# EAGLE design umidade_V1.0 (EAGLE 4.09)
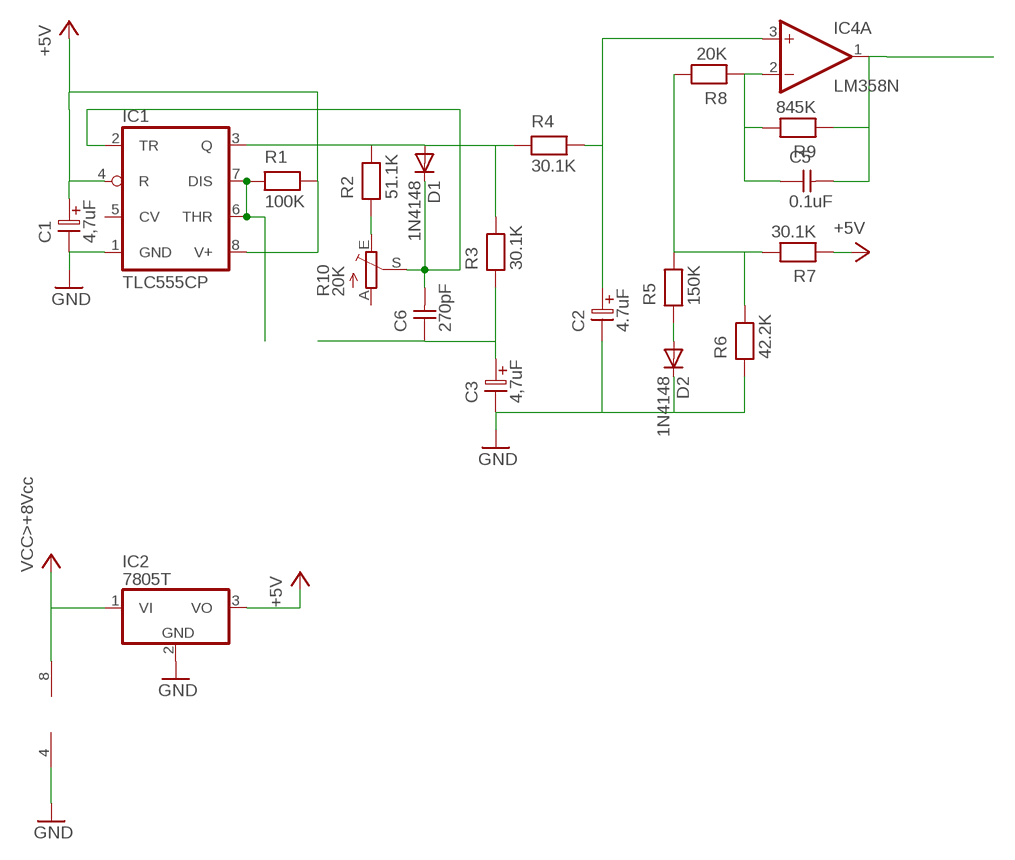
[diagram p0: schematic, sheet 1]

## Parts
C1  4,7uF  ELC-2,5L  [ES-2,5L]
C2  4.7uF  ELC-2,5L  [ES-2,5L]
C3  4,7uF  ELC-2,5L  [ES-2,5L]
C5  0.1uF  CAPNP-5  [C-5]
C6  270pF  CAPNP-2,5  [C-2,5]
D1  1N4148  [DO35-10]
D2  1N4148  [DO35-10]
IC1  TLC555CP  SE555N  [DIL08]
IC2  7805T  [TO220H]
IC4  LM358N  [DIL08]
R1  100K  RESEU-7,5  [R-7,5]
R2  51.1K  RESEU-7,5  [R-7,5]
R3  30.1K  RESEU-7,5  [R-7,5]
R4  30.1K  RESEU-7,5  [R-7,5]
R5  150K  RESEU-7,5  [R-7,5]
R6  42.2K  RESEU-7,5  [R-7,5]
R7  30.1K  RESEU-7,5  [R-7,5]
R8  20K  RESEU-7,5  [R-7,5]
R9  845K  RESEU-7,5  [R-7,5]
R10  20K  TRIM_EU-S64W  [S64W]

## Nets
+5V: C1.1 IC1.4(R) IC1.8(V+) IC2.3(VO) R1.2 R7.1
GND: C1.2 C2.2 C3.2 D2.C IC1.1(GND) IC2.2(GND) IC4.4(P:V-) R6.1
N$1: R2.1 R10.E
N$2: C6.2 D1.C IC1.2(TR) R10.S
N$3: IC1.6(THR) IC1.7(DIS) R1.1
N$4: D1.A IC1.3(Q) R2.2 R3.2 R4.1
N$6: C3.1 C6.1 R3.1
N$7: C5.2 IC4.1(A:OUT) R9.1
N$8: C5.1 IC4.2(A:-IN) R8.1 R9.2
N$9: D2.A R5.1
N$10: R5.2 R6.2 R7.2 R8.2
N$11: C2.1 IC4.3(A:+IN) R4.2
VCC>8VCC: IC2.1(VI) IC4.8(P:V+) ; supply symbol labelled VCC>+8Vcc
Unconnected: IC1.5(CV) IC4.5(B:+IN) IC4.6(B:-IN) IC4.7(B:OUT) R10.A

## Library data of the parts
C1-C3 = discrete:ELC-2,5L
C5 = discrete:CAPNP-5
C6 = discrete:CAPNP-2,5
D1 D2 = diode:1N4148: DIODE high speed (Philips)
IC1 = linear:*555: TIMER
IC2 = linear:78*: Positive VOLTAGE REGULATOR
IC4 = linear:LM358: OP AMP
R1-R9 = discrete:RESEU-7,5
R10 = pot:TRIM_EU-: POTENTIOMETER

## Board
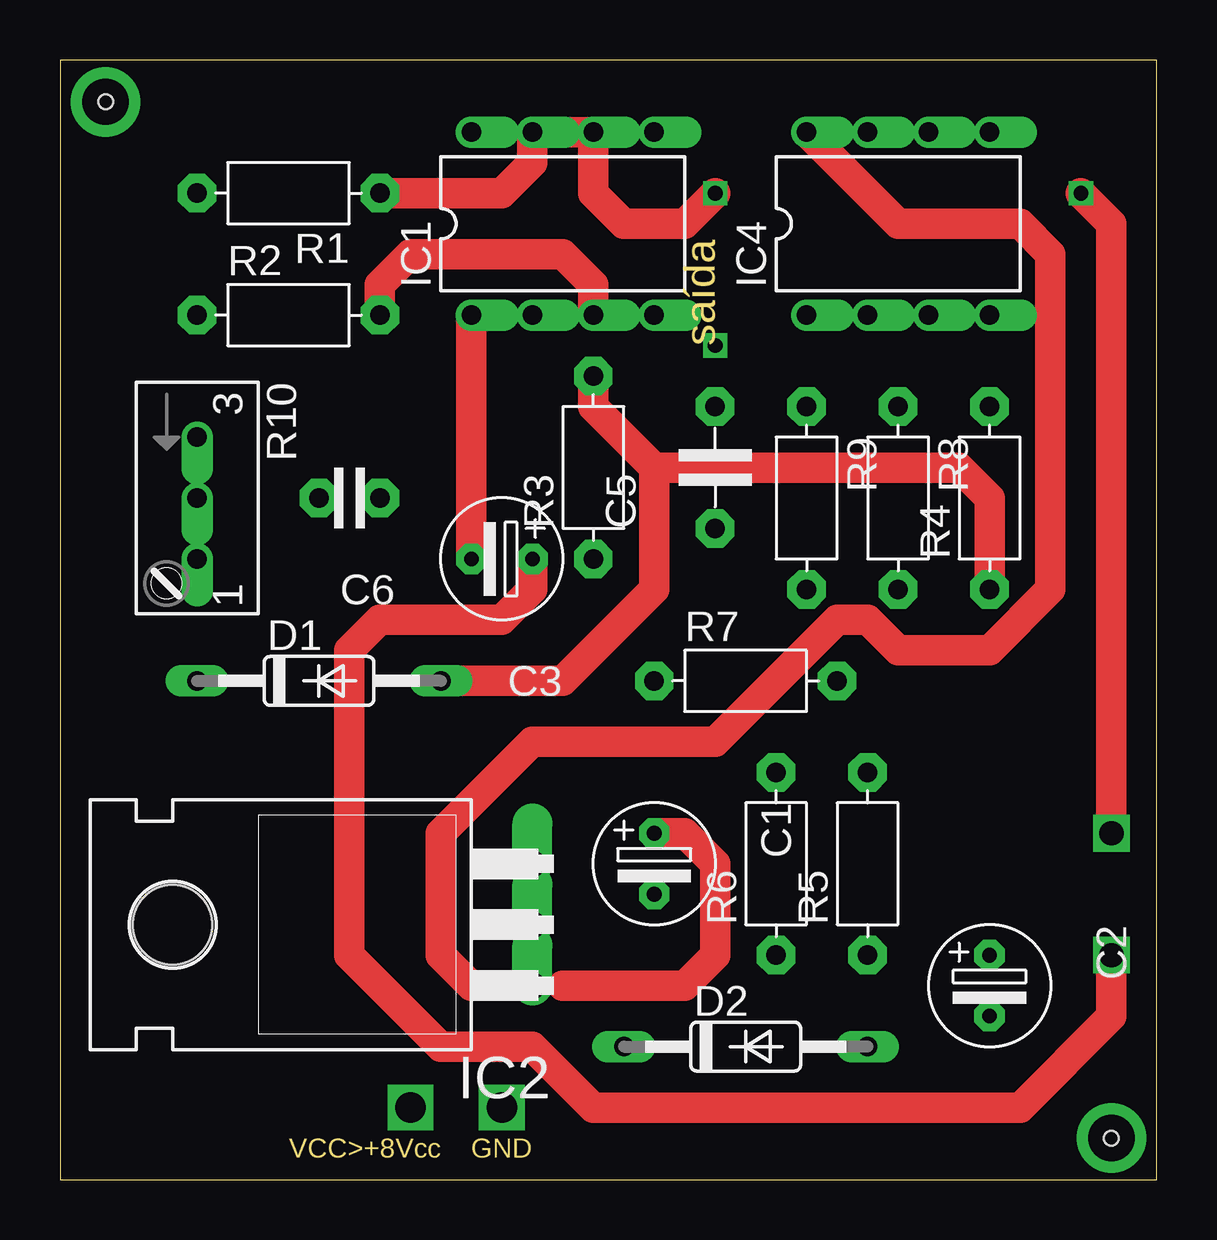
[diagram p1: board, top side]
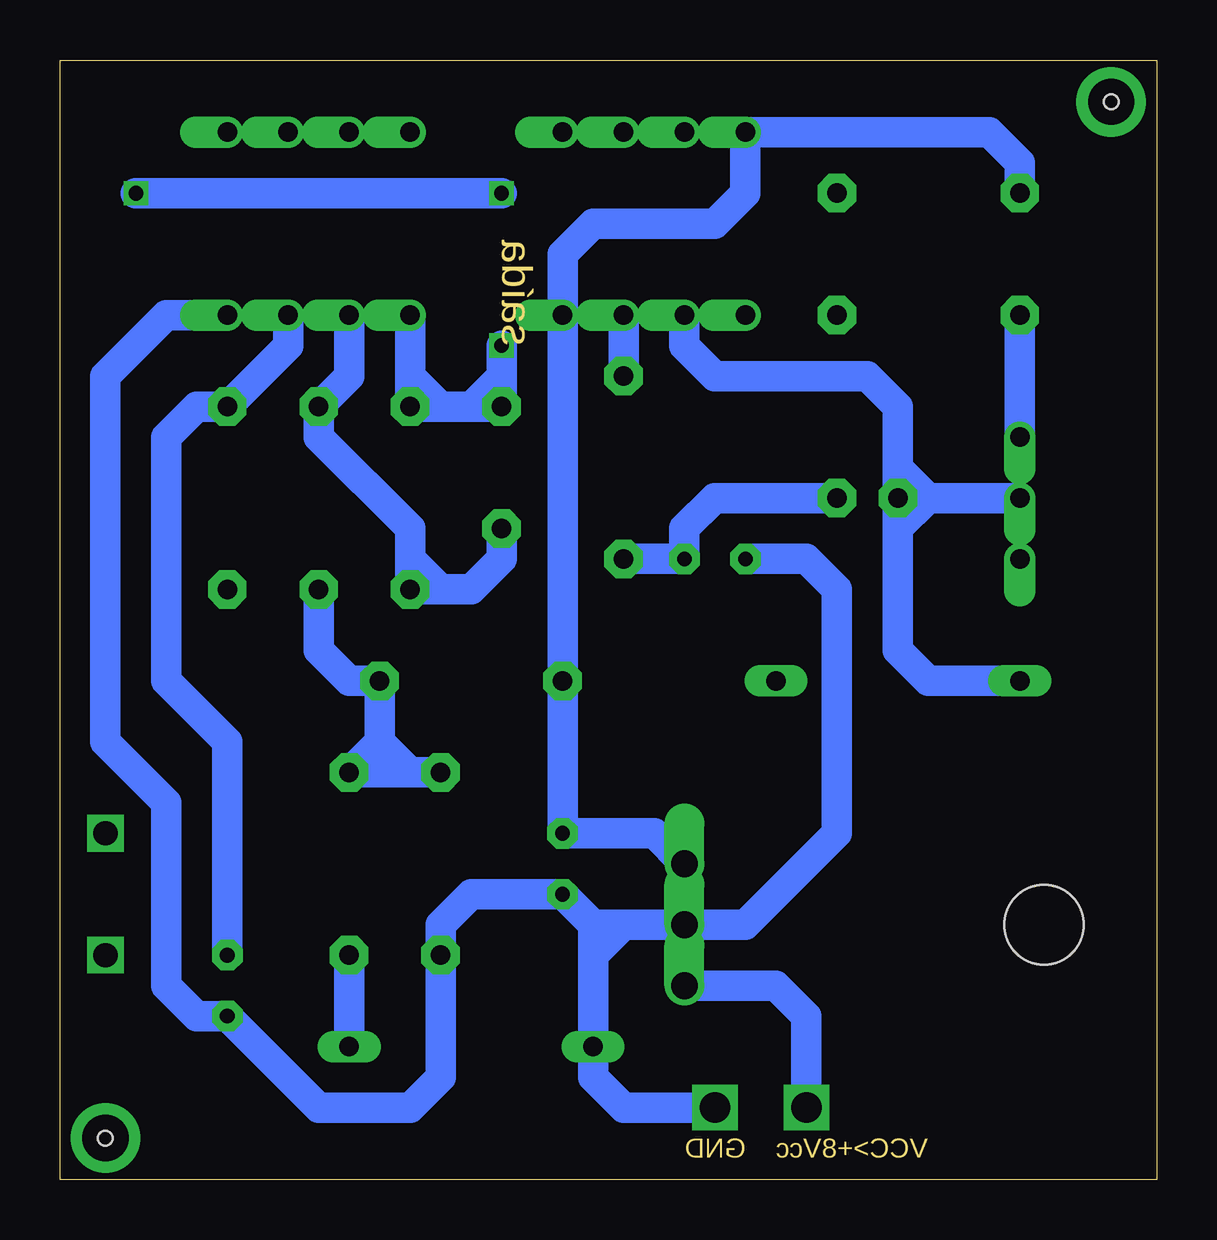
[diagram p2: board, bottom side, seen from below]

Size 45.7 x 46.66 mm. Coordinates in mm from the lower left corner, seen from the top.
Outline: 0,0 45.7,0 45.7,46.66 0,46.66 0,0
Copper layers used: Top, Bottom
Holes 0.61 mm at 1.9,44.92 43.81,1.74

### Footprints (pad centres in the part's own frame; a part is rotated, then mirrored left to right if it is on the bottom)
ES-2,5L = drill 0.61 pad 1.27 octagon: 1 0,0; 2 2.54,0
C-5 = drill 0.813 pad 1.6 octagon: 1 -2.54,0; 2 2.54,0
C-2,5 = drill 0.813 pad 1.6 octagon: 1 -1.27,0; 2 1.27,0
DO35-10 = drill 0.813 long: A 5.08,0; C -5.08,0
DIL08 = drill 0.813 offset: 1 -3.81,-3.81; 2 -1.27,-3.81; 3 1.27,-3.81; 4 3.81,-3.81; 5 3.81,3.81; 6 1.27,3.81; 7 -1.27,3.81; 8 -3.81,3.81
TO220H = drill 1.118 offset: 1 -2.54,-10.16; 2 0,-10.16; 3 2.54,-10.16 | hole 3.302: 0,4.826
R-7,5 = drill 0.813 pad 1.6 octagon: 1 -3.81,0; 2 3.81,0
S64W = drill 0.813 offset: A 2.54,1.27; E -2.54,1.27; S 0,1.27

### Placement (x,y rotation side)
C1  24.76,14.44 270 top
C2  38.73,9.36 270 top
C3  19.68,25.87 180 top
C5  27.3,29.68 90 top
C6  12.06,28.41 180 top
D1  10.79,20.79 0 top
D2  28.57,5.55 0 top
IC1  20.95,39.84 0 top
IC2  9.52,10.63 90 top
IC4  34.92,39.84 0 top
R1  9.52,41.11 180 top
R2  9.52,36.03 0 top
R3  22.22,29.68 90 top
R4  38.73,28.41 90 top
R5  33.65,13.17 90 top
R6  29.84,13.17 90 top
R7  28.57,20.79 0 top
R8  34.92,28.41 270 top
R9  31.11,28.41 270 top
R10  4.44,28.41 270 top

### Tracks (layer width: path | path; a pad name or v marks a point on that pad's centre or on a via)
+5V
  Top 1.27: 20.95,8.09 26.03,8.09 27.3,9.36 27.3,13.17 26.03,14.44 C1.1
  Bottom 1.27: R1.2 5.71,42.38 6.98,43.65 IC1.8 17.14,41.11 18.41,39.84 23.49,39.84 24.76,38.57 IC1.4 R7.1 C1.1 20.95,14.44 IC2.3
GND  (via drill 1.27)
  Top 1.27: C3.2 IC1.1
  Bottom 1.27: 29.84,10.63 R6.1 | 29.84,10.63 28.57,11.9 C1.2 23.49,10.63 | C3.2 14.6,25.87 13.33,24.6 13.33,14.44 17.14,10.63 IC2.2 22.22,10.63 | IC4.4 41.27,36.03 43.81,33.49 43.81,18.25 41.27,15.71 41.27,8.09 40,6.82 C2.2 34.92,3.01 31.11,3.01 29.84,4.28 29.84,10.63 | v18.41,3.01 22.22,3.01 23.49,4.28 D2.C 23.49,9.36 | 23.49,10.63 22.22,10.63 | 23.49,9.36 23.49,10.63 | 23.49,9.36 22.22,10.63
N$1
  Bottom 1.27: R10.E R2.1
N$2
  Bottom 1.27: C6.2 9.52,28.41 | 9.52,28.41 R10.S | D1.C 9.52,20.79 10.79,22.06 10.79,27.14 | 10.79,27.14 C6.2 | IC1.2 19.68,34.76 18.41,33.49 12.06,33.49 10.79,32.22 10.79,29.68 | C6.2 10.79,29.68 | 9.52,28.41 10.79,29.68 | 10.79,29.68 10.79,27.14 | 10.79,27.14 9.52,28.41
N$3  (via drill 0.61, 1.02)
  Top 1.27: R1.1 18.41,41.11 19.68,42.38 IC1.7 IC1.6 22.22,41.11 23.49,39.84 26.03,39.84 v27.3,41.11 | v43.81,14.44 43.81,39.84 v42.54,41.11
  Bottom 1.27: v27.3,41.11 v42.54,41.11
N$4
  Top 1.27: R2.2 13.33,37.3 14.6,38.57 20.95,38.57 22.22,37.3 IC1.3 | R3.2 22.22,32.22 24.76,29.68 | 24.76,29.68 37.46,29.68 38.73,28.41 R4.1 | D1.A 20.95,20.79 24.76,24.6 24.76,29.68
  Bottom 1.27: R3.2 IC1.3
N$6  (via drill 1.02)
  Top 1.27: C3.1 19.68,24.6 18.41,23.33 13.33,23.33 12.06,22.06 12.06,9.36 15.87,5.55 19.68,5.55 22.22,3.01 40,3.01 43.81,6.82 v43.81,9.36
  Bottom 1.27: C6.1 18.41,28.41 19.68,27.14 C3.1 R3.1
N$7  (via drill 0.61)
  Bottom 1.27: 28.57,32.22 C5.2 27.3,33.49 | 28.57,32.22 29.84,32.22 | 29.84,32.22 R9.1 31.11,33.49 | 31.11,33.49 IC4.1 | 29.84,32.22 31.11,33.49 | 27.3,33.49 v27.3,34.76 | 27.3,33.49 28.57,32.22
N$8
  Bottom 1.27: IC4.2 33.65,33.49 R8.1 34.92,30.95 31.11,27.14 31.11,25.87 | C5.1 27.3,25.87 28.57,24.6 29.84,24.6 | 29.84,24.6 R9.2 31.11,25.87 | 29.84,24.6 31.11,25.87
N$9
  Bottom 1.27: D2.A R5.1
N$10
  Bottom 1.27: R8.2 34.92,22.06 33.65,20.79 R7.2 32.38,18.25 | R6.2 31.11,16.98 | 31.11,16.98 R5.2 32.38,18.25 | 31.11,16.98 32.38,18.25
N$11
  Bottom 1.27: IC4.3 36.19,34.76 R4.2 40,32.22 41.27,30.95 41.27,20.79 38.73,18.25 C2.1
N$13  (via drill 1.93)
  other vias: 1.9,44.92
N$14  (via drill 1.93)
  other vias: 43.81,1.74
VCC>8VCC  (via drill 1.27)
  Top 1.27: IC2.1 17.14,8.09 15.87,9.36 15.87,14.44 19.68,18.25 27.3,18.25 32.38,23.33 33.65,23.33 34.92,22.06 38.73,22.06 41.27,24.6 41.27,38.57 40,39.84 34.92,39.84 IC4.8
  Bottom 1.27: v14.6,3.01 14.6,6.82 15.87,8.09 IC2.1

### Text on the board
Dimension: saída | VCC>+8Vcc | GND